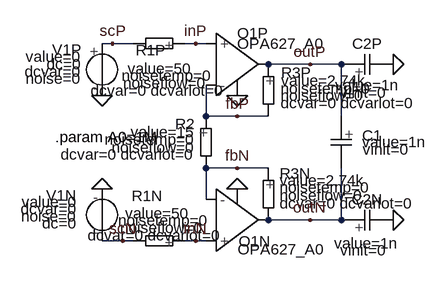
[diagram p0: schematic balancedAmp.asc]
balancedAmp.asc, the LTspice schematic file:
Version 4
SHEET 1 880 680
WIRE 16 -16 0 -16
WIRE 48 -16 16 -16
WIRE 144 -16 128 -16
WIRE 160 -16 144 -16
WIRE 320 16 256 16
WIRE 368 16 320 16
WIRE 160 96 160 48
WIRE 208 96 160 96
WIRE 256 96 208 96
WIRE 368 96 368 16
WIRE 208 176 160 176
WIRE 256 176 208 176
WIRE 160 224 160 176
WIRE 320 256 256 256
WIRE 368 256 368 176
WIRE 368 256 320 256
WIRE 32 288 0 288
WIRE 48 288 32 288
WIRE 144 288 128 288
WIRE 160 288 144 288
FLAG 208 64 0
FLAG 208 208 0
FLAG 448 16 0
FLAG 448 256 0
FLAG 0 64 0
FLAG 0 208 0
FLAG 320 16 outP
FLAG 320 256 outN
FLAG 144 -16 inP
FLAG 144 288 inN
FLAG 208 96 fbP
FLAG 208 176 fbN
FLAG 16 -16 scP
FLAG 32 288 scN
SYMBOL SLO 176 256 M180
WINDOW 0 34 -33 Left 2
WINDOW 3 33 -45 Left 2
SYMATTR InstName O1N
SYMATTR Value OPA627_A0
SYMBOL SLR 160 96 M0
WINDOW 0 17 12 Left 2
WINDOW 123 16 36 Left 2
WINDOW 39 17 48 Left 2
WINDOW 40 17 59 Left 2
SYMATTR InstName R2
SYMATTR Value value=15
SYMBOL SLR 256 16 R0
WINDOW 0 20 13 Left 2
WINDOW 3 20 25 Left 2
WINDOW 123 19 37 Left 2
WINDOW 39 19 48 Left 2
WINDOW 40 19 60 Left 2
SYMATTR InstName R3P
SYMATTR Value value=2.74k
SYMBOL SLO 176 16 R0
SYMATTR InstName O1P
SYMATTR Value OPA627_A0
SYMBOL SLR 256 176 R0
WINDOW 0 17 8 Left 2
WINDOW 3 17 19 Left 2
WINDOW 123 17 30 Left 2
WINDOW 39 17 42 Left 2
WINDOW 40 17 54 Left 2
SYMATTR InstName R3N
SYMATTR Value value=2.74k
SYMBOL SLC 368 96 R0
WINDOW 0 32 30 Left 2
WINDOW 123 33 51 Left 2
SYMATTR InstName C1
SYMATTR Value value=1n
SYMBOL SLC 368 16 M90
WINDOW 0 -16 40 VBottom 2
WINDOW 3 16 40 VTop 2
WINDOW 123 28 34 VTop 2
SYMATTR InstName C2P
SYMATTR Value value=1n
SYMBOL SLC 368 256 M90
WINDOW 0 -16 40 VBottom 2
WINDOW 3 20 39 VTop 2
WINDOW 123 31 34 VTop 2
SYMATTR InstName C2N
SYMATTR Value value=1n
SYMBOL SLV 0 -16 M0
WINDOW 3 32 20 Left 2
WINDOW 123 32 32 Left 2
WINDOW 39 32 43 Left 2
WINDOW 40 32 54 Left 2
SYMATTR InstName V1P
SYMBOL SLV 0 288 R180
WINDOW 123 39 27 Left 2
WINDOW 39 38 49 Left 2
WINDOW 40 39 38 Left 2
WINDOW 0 39 70 Left 2
WINDOW 3 38 60 Left 2
SYMATTR InstName V1N
SYMBOL SLR 128 -16 R90
WINDOW 0 26 53 VBottom 2
WINDOW 3 23 39 VTop 2
WINDOW 123 34 28 VTop 2
WINDOW 39 45 31 VTop 2
WINDOW 40 57 42 VTop 2
SYMATTR InstName R1P
SYMATTR Value value=50
SYMBOL SLR 128 288 R90
WINDOW 0 -54 58 VBottom 2
WINDOW 3 -58 43 VTop 2
WINDOW 123 -47 33 VTop 2
WINDOW 39 -36 36 VTop 2
WINDOW 40 -24 47 VTop 2
SYMATTR InstName R1N
SYMATTR Value value=50
TEXT -72 128 Left 2 !.param A0=1M

The netlist it stands for:
* balancedAmp.asc
O1N inN fbN outN 0 OPA627_A0
R2 fbP fbN R value=15 noisetemp=0 noiseflow=0 dcvar=0 dcvarlot=0
R3P outP fbP R value=2.74k noisetemp=0 noiseflow=0 dcvar=0 dcvarlot=0
O1P inP fbP outP 0 OPA627_A0
R3N fbN outN R value=2.74k noisetemp=0 noiseflow=0 dcvar=0 dcvarlot=0
C1 outP outN C value=1n vinit=0
C2P outP 0 C value=1n vinit=0
C2N outN 0 C value=1n vinit=0
V1P scP 0 V value=0 dc=0 dcvar=0 noise=0
V1N scN 0 V value=0 dc=0 dcvar=0 noise=0
R1P inP scP R value=50 noisetemp=0 noiseflow=0 dcvar=0 dcvarlot=0
R1N inN scN R value=50 noisetemp=0 noiseflow=0 dcvar=0 dcvarlot=0
.param A0=1M
.backanno
.end